# Altium schematic sheet Power.SchDoc
size A
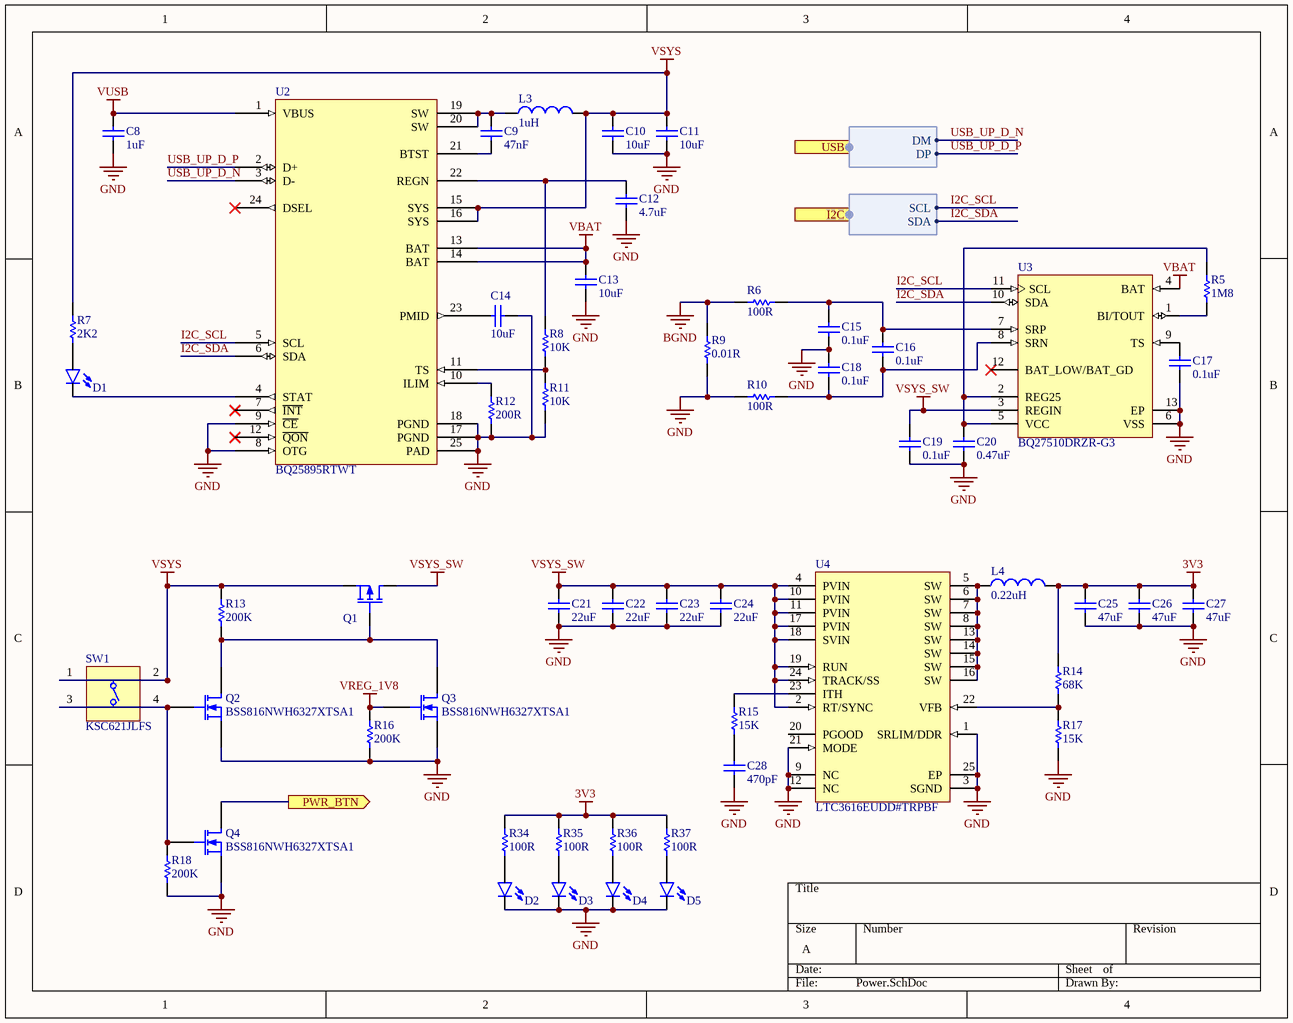
[diagram p0: Power.SchDoc]

## Parts
C8  value 1uF  [C0402[1005X55]]  (hidden comment: 1uF 16V 0402)
C9  value 47nF  [C0402[1005X55]]  (hidden comment: 47nF 16V 0402)
C10  value 10uF  [C0402[1005X55]]  (hidden comment: 10uF 6.3V 0402)
C11  value 10uF  [C0402[1005X55]]  (hidden comment: 10uF 6.3V 0402)
C12  value 4.7uF  [C0402[1005X55]]  (hidden comment: 4.7uF 10V 0402)
C13  value 10uF  [C0402[1005X55]]  (hidden comment: 10uF 6.3V 0402)
C14  value 10uF  [C0603[1608X92]]  (hidden comment: 10uF 35V 0603)
C15  value 0.1uF  [C0402[1005X55]]  (hidden comment: 0.1uF 6.3V 0402)
C16  value 0.1uF  [C0402[1005X55]]  (hidden comment: 0.1uF 6.3V 0402)
C17  value 0.1uF  [C0402[1005X55]]  (hidden comment: 0.1uF 6.3V 0402)
C18  value 0.1uF  [C0402[1005X55]]  (hidden comment: 0.1uF 6.3V 0402)
C19  value 0.1uF  [C0402[1005X55]]  (hidden comment: 0.1uF 6.3V 0402)
C20  value 0.47uF  [C0402[1005X55]]  (hidden comment: 0.47uF 25V 0402)
C21  value 22uF  [C0603[1608X92]]  (hidden comment: 22uF 6.3V 0603)
C22  value 22uF  [C0603[1608X92]]  (hidden comment: 22uF 6.3V 0603)
C23  value 22uF  [C0603[1608X92]]  (hidden comment: 22uF 6.3V 0603)
C24  value 22uF  [C0603[1608X92]]  (hidden comment: 22uF 6.3V 0603)
C25  value 47uF  [C1206[3216X160]]  (hidden comment: 47uF 6.3V 1206)
C26  value 47uF  [C1206[3216X160]]  (hidden comment: 47uF 6.3V 1206)
C27  value 47uF  [C1206[3216X160]]  (hidden comment: 47uF 6.3V 1206)
C28  value 470pF  [C0402[1005X55]]  (hidden comment: 470pF 50V 0402)
D1  LED_0603_GREEN_5mA  [LED0603]  (value not drawn)
D2  LED_0603_BLUE_5mA  [LED0603]  (value not drawn)
D3  LED_0603_BLUE_5mA  [LED0603]  (value not drawn)
D4  LED_0603_BLUE_5mA  [LED0603]  (value not drawn)
D5  LED_0603_BLUE_5mA  [LED0603]  (value not drawn)
L3  1uH  [IND1008]
L4  0.22uH  [IND1008]
Q1  SIS407DN-T1-GE3  [PowerPak-1212-8]  (value not drawn)
Q2  BSS816NWH6327XTSA1  [SOT323-3]
Q3  BSS816NWH6327XTSA1  [SOT323-3]
Q4  BSS816NWH6327XTSA1  [SOT323-3]
R5  value 1M8  [R0402[1005]]  (hidden comment: 1M8 1% 0402)
R6  value 100R  [R0402[1005]]  (hidden comment: 100R 1% 0402)
R7  value 2K2  [R0402[1005]]  (hidden comment: 2K2 1% 0402)
R8  value 10K  [R0402[1005]]  (hidden comment: 10K 1% 0402)
R9  value 0.01R  [R1206[3216]]  (hidden comment: 0.01R 1% 1206)
R10  value 100R  [R0402[1005]]  (hidden comment: 100R 1% 0402)
R11  value 10K  [R0402[1005]]  (hidden comment: 10K 1% 0402)
R12  value 200R  [R0402[1005]]  (hidden comment: 200R 1% 0402)
R13  value 200K  [R0402[1005]]  (hidden comment: 200K 1% 0402)
R14  value 68K  [R0402[1005]]  (hidden comment: 68K 1% 0402)
R15  value 15K  [R0402[1005]]  (hidden comment: 15K 1% 0402)
R16  value 200K  [R0402[1005]]  (hidden comment: 200K 1% 0402)
R17  value 15K  [R0402[1005]]  (hidden comment: 15K 1% 0402)
R18  value 200K  [R0402[1005]]  (hidden comment: 200K 1% 0402)
R34  value 100R  [R0402[1005]]  (hidden comment: 100R 1% 0402)
R35  value 100R  [R0402[1005]]  (hidden comment: 100R 1% 0402)
R36  value 100R  [R0402[1005]]  (hidden comment: 100R 1% 0402)
R37  value 100R  [R0402[1005]]  (hidden comment: 100R 1% 0402)
SW1  KSC621JLFS  [SWITCH]
U2  BQ25895RTWT  [WQFN-24]
U3  BQ27510DRZR-G3  [VSON-12]
U4  LTC3616EUDD#TRPBF  [LT-UDD-24_L]

## Ports
I2C (harness I2C), PWR_BTN (out), USB (harness USB)

## Harnesses
I2C: SCL, SDA
USB: DM, DP

## Nets
3V3: C25.2 C26.2 C27.2 L4.2 R14.2 R34.1 R35.1 R36.1 R37.1
BGND: R6.1 R9.2
GND: C8.1 C10.1 C11.1 C12.1 C13.1 C14.1 C15.1 C17.1 C18.2 C19.1 C20.1 C21.1 C22.1 C23.1 C24.1 C25.1 C26.1 C27.1 C28.1 D2.C D3.C D4.C D5.C Q2.2(S) Q3.2(S) Q4.2(S) R9.1 R10.1 R11.1 R12.1 R16.1 R17.1 R18.1 U2.8(OTG) U2.9(~{CE}) U2.17(PGND) U2.18(PGND) U2.25(PAD) U3.6(VSS) U3.13(EP) U4.1(SRLIM/DDR) U4.3(SGND) U4.9(NC) U4.12(NC) U4.21(MODE) U4.25(EP)
VBAT: C13.2 U2.13(BAT) U2.14(BAT) U3.4(BAT)
VREG_1V8: Q3.1(G) R16.2
VSYS: C10.2 C11.2 L3.2 Q1.1(S) R7.2 R13.2 SW1.1(T1) SW1.2(T2) U2.15(SYS) U2.16(SYS)
VSYS_SW: C19.2 C21.2 C22.2 C23.2 C24.2 Q1.3(D) U3.3(REGIN) U4.2(RT/SYNC) U4.4(PVIN) U4.10(PVIN) U4.11(PVIN) U4.17(PVIN) U4.18(SVIN) U4.19(RUN) U4.24(TRACK/SS)
VUSB: C8.2 U2.1(VBUS)
I2C_SCL: U2.5(SCL) U3.11(SCL) ; port I2C.SCL
I2C_SDA: U2.6(SDA) U3.10(SDA) ; port I2C.SDA
PWR_BTN: Q4.3(D) ; port PWR_BTN
USB_UP_D_N: U2.3(D-) ; port USB.DM
USB_UP_D_P: U2.2(D+) ; port USB.DP
NetC9_1: C9.1 U2.21(BTST)
NetC9_2: C9.2 L3.1 U2.19(SW) U2.20(SW)
NetC12_2: C12.2 R8.2 U2.22(REGN)
NetC14_2: C14.2 U2.23(PMID)
NetC15_2: C15.2 C16.2 R6.2 U3.7(SRP)
NetC16_1: C16.1 C18.1 R10.2 U3.8(SRN)
NetC17_2: C17.2 U3.9(TS)
NetC20_2: C20.2 R5.2 U3.2(REG25) U3.5(VCC)
NetC28_2: C28.2 R15.1
NetD1_A: D1.A R7.1
NetD1_C: D1.C U2.4(STAT)
NetD2_A: D2.A R34.2
NetD3_A: D3.A R35.2
NetD4_A: D4.A R36.2
NetD5_A: D5.A R37.2
NetL4_1: L4.1 U4.5(SW) U4.6(SW) U4.7(SW) U4.8(SW) U4.13(SW) U4.14(SW) U4.15(SW) U4.16(SW)
NetQ1_2: Q1.2(G) Q2.3(D) Q3.3(D) R13.1
NetQ2_1: Q2.1(G) Q4.1(G) R18.2 SW1.3(T3) SW1.4(T3)
NetR5_1: R5.1 U3.1(BI/TOUT)
NetR8_1: R8.1 R11.2 U2.11(TS)
NetR12_2: R12.2 U2.10(ILIM)
NetR14_1: R14.1 R17.2 U4.22(VFB)
NetR15_2: R15.2 U4.23(ITH)

Not connected (* = marked no-connect by the designer): U2 7(~{INT})* 12(~{QON})* 24(DSEL)*; U3 12(BAT_LOW/BAT_GD)*; U4 20(PGOOD)

## Library data of the parts
C8 = CAP_1uF_16V_0402_10%: 1uF 16V 10% 0402 (1005 Metric); PartNumber: GRM155R61C105KE01D; Manufacturer: Murata; Mounting Technology: Surface Mount; PackageReference: 0402; PackageDescription: 0402 (1005 Metric); Voltage: 16V; Tolerance: 10%
C9 = CAP_47nF_16V_0402_10%: 47nF 16V 10% 0402 (1005 Metric); PartNumber: GCM155R71C473KA37D; Manufacturer: Murata; Mounting Technology: Surface Mount; PackageReference: 0402; PackageDescription: 0402 (1005 Metric); Voltage: 16V; Tolerance: 10%
C10 C11 C13 = CAP_10uF_6.3V_0402_20%: 10uF 6.3V 20% 0402 (1005 Metric); PartNumber: GRM155R60J106ME44D; Manufacturer: Murata; Mounting Technology: Surface Mount; PackageReference: 0402; PackageDescription: 0402 (1005 Metric); Voltage: 6.3V; Tolerance: 20%
C12 = CAP_4.7uF_10V_0402_10%: 4.7uF 10V 10% 0402 (1005 Metric); PartNumber: ZRB15XR61A475KE01D; Manufacturer: Murata; Mounting Technology: Surface Mount; PackageReference: 0402; PackageDescription: 0402 (1005 Metric); Voltage: 10V; Tolerance: 10%
C14 = CAP_10uF_35V_0603_10%: 10uF 35V 10% 0603 (1608 Metric); PartNumber: GRM188R6YA106MA73D; Manufacturer: Murata; Mounting Technology: Surface Mount; PackageReference: 0603; PackageDescription: 0603 (1608 Metric); Voltage: 35V; Tolerance: 10%
C15-C19 = CAP_0.1uF_6.3V_0402_10%: 0.1uF 6.3V 10% 0402 (1005 Metric); PartNumber: GRM155R70J104KA01D; Manufacturer: Murata; Mounting Technology: Surface Mount; PackageReference: 0402; PackageDescription: 0402 (1005 Metric); Voltage: 6.3V; Tolerance: 10%
C20 = CAP_0.47uF_25V_0402_10%: 0.47uF 25V 10% 0402 (1005 Metric); PartNumber: GRM155R61E474KE01D; Manufacturer: Murata; Mounting Technology: Surface Mount; PackageReference: 0402; PackageDescription: 0402 (1005 Metric); Voltage: 25V; Tolerance: 10%
C21-C24 = CAP_22uF_6.3V_0603_10%: 22uF 6.3V 10% 0603 (1608 Metric); PartNumber: GRT188R60J226ME13D; Manufacturer: Murata; Mounting Technology: Surface Mount; PackageReference: 0603; PackageDescription: 0603 (1608 Metric); Voltage: 6.3V; Tolerance: 10%
C25-C27 = CAP_47uF_6.3V_1206_10%: 47uF 6.3V 10% 1206 (3216 Metric); PartNumber: GRM31CR60J476KE19L; Manufacturer: Murata; Mounting Technology: Surface Mount; PackageReference: 1206; PackageDescription: 1206 (3216 Metric); Voltage: 6.3V; Tolerance: 10%
C28 = CAP_470pF_50V_0402_5%: 470pF 50V 5% 0402 (1005 Metric); PartNumber: GCM1555C1H471JA16D; Manufacturer: Murata; Mounting Technology: Surface Mount; PackageReference: 0402; PackageDescription: 0402 (1005 Metric); Voltage: 50V; Tolerance: 5%
D1 = LED_0603_GREEN_5mA: PartNumber: LTST-C193TGKT-5A; Manufacturer: Lite-On Inc.; PackageReference: 0603; PackageDescription: 0603 (1608 Metric); Mounting Technology: Surface Mount
D2-D5 = LED_0603_BLUE_5mA: PartNumber: LTST-C193TBKT-5A; Manufacturer: Lite-On Inc.; PackageReference: 0603; PackageDescription: 0603 (1608 Metric); Mounting Technology: Surface Mount
L3 = IND_1uH_4.7A_1008_20%: 1uH 20% 4.7A 1008; PartNumber: DFE252012F-2R2M=P2; Manufacturer: Murata; PackageReference: 1008; PackageDescription: 1008 (2520 metric); Mounting Technology: Surface Mount; Current: 4.7A; Value: 1uH
L4 = IND_0.22uH_6.7A_1008_20%: 0.22uH 20% 6.7A 1008; PartNumber: TFM252012ALMAR22MTAA; Manufacturer: Murata; PackageReference: 1008; PackageDescription: 1008 (2520 metric); Mounting Technology: Surface Mount; Current: 6.7A; Value: 0.22uH
Q1 = SIS407DN-T1-GE3: P-Channel MOSFET; Manufacturer: Vishay; PartNumber: SIS407DN-T1-GE3; Mounting Technology: Surface Mount; PackageReference: PowerPAK-1212-8
Q2-Q4 = BSS816NWH6327XTSA1: N-Channel MOSFET; Manufacturer: Infineon Technologies; PartNumber: BSS816NWH6327XTSA1; PackageReference: SOT-323-3; Mounting Technology: Surface Mount
R5 = RES_1M8_0402_1%: 1M8 0.063W 1% 0402 (1005 Metric); Manufacturer: KOA Speer; PartNumber: RK73H1ETTP1804F; Tolerance: 1%; Power: 0.063W; Mounting Technology: Surface Mount; PackageReference: 0402; PackageDescription: 0402 (1005 Metric); ComponentLink1Description: Datasheet; ComponentLink1URL: http://www.koaspeer.com/catimages/Products/RK73H/RK73H.pdf
R6 R10 R34-R37 = RES_100R_0402_1%: 100R 0.063W 1% 0402 (1005 Metric); Manufacturer: KOA Speer; PartNumber: RK73H1ETTP1000F; Tolerance: 1%; Power: 0.063W; Mounting Technology: Surface Mount; PackageReference: 0402; PackageDescription: 0402 (1005 Metric); ComponentLink1Description: Datasheet; ComponentLink1URL: http://www.koaspeer.com/catimages/Products/RK73H/RK73H.pdf
R7 = RES_2K2_0402_1%: 2K2 0.063W 1% 0402 (1005 Metric); Manufacturer: KOA Speer; PartNumber: RK73H1ETTP2201F; Tolerance: 1%; Power: 0.063W; Mounting Technology: Surface Mount; PackageReference: 0402; PackageDescription: 0402 (1005 Metric); ComponentLink1Description: Datasheet; ComponentLink1URL: http://www.koaspeer.com/catimages/Products/RK73H/RK73H.pdf
R8 R11 = RES_10K_0402_1%: 10K 0.063W 1% 0402 (1005 Metric); Manufacturer: KOA Speer; PartNumber: RK73H1ETTP1002F; Tolerance: 1%; Power: 0.063W; Mounting Technology: Surface Mount; PackageReference: 0402; PackageDescription: 0402 (1005 Metric); ComponentLink1Description: Datasheet; ComponentLink1URL: http://www.koaspeer.com/catimages/Products/RK73H/RK73H.pdf
R9 = RES_0.01R_1206_1%_1.5W: 0.01R 1.5W 1% 1206 (3216 Metric); Manufacturer: KOA Speer; PartNumber: TLR2BPDTD10L0F75; Tolerance: 1%; Power: 1.5W; Mounting Technology: Surface Mount; PackageReference: 1206; PackageDescription: 1206 (3216 Metric)
R12 = RES_200R_0402_1%: 200R 0.063W 1% 0402 (1005 Metric); Manufacturer: KOA Speer; PartNumber: RK73H1ETTP2000F; Tolerance: 1%; Power: 0.063W; Mounting Technology: Surface Mount; PackageReference: 0402; PackageDescription: 0402 (1005 Metric); ComponentLink1Description: Datasheet; ComponentLink1URL: http://www.koaspeer.com/catimages/Products/RK73H/RK73H.pdf
R13 R16 R18 = RES_200K_0402_1%: 200K 0.063W 1% 0402 (1005 Metric); Manufacturer: KOA Speer; PartNumber: RK73H1ETTP2003F; Tolerance: 1%; Power: 0.063W; Mounting Technology: Surface Mount; PackageReference: 0402; PackageDescription: 0402 (1005 Metric); ComponentLink1Description: Datasheet; ComponentLink1URL: http://www.koaspeer.com/catimages/Products/RK73H/RK73H.pdf
R14 = RES_68K_0402_1%: 68K 0.063W 1% 0402 (1005 Metric); Manufacturer: KOA Speer; PartNumber: RK73H1ETTP6802F; Tolerance: 1%; Power: 0.063W; Mounting Technology: Surface Mount; PackageReference: 0402; PackageDescription: 0402 (1005 Metric); ComponentLink1Description: Datasheet; ComponentLink1URL: http://www.koaspeer.com/catimages/Products/RK73H/RK73H.pdf
R15 R17 = RES_15K_0402_1%: 15K 0.063W 1% 0402 (1005 Metric); Manufacturer: KOA Speer; PartNumber: RK73H1ETTP1502F; Tolerance: 1%; Power: 0.063W; Mounting Technology: Surface Mount; PackageReference: 0402; PackageDescription: 0402 (1005 Metric); ComponentLink1Description: Datasheet; ComponentLink1URL: http://www.koaspeer.com/catimages/Products/RK73H/RK73H.pdf
SW1 = KSC621JLFS: Switch, SPNO Push Button SMD; Manufacturer: C&K Components; Packing Type: Tape&Reel; Mechanical Life: 200,000 cycles; ComponentLink2URL: http://www.dip.com.tw/Products_tact.htm; ComponentLink1URL: http://www.dip.com.tw/; ComponentLink3URL: http://www.dip.com.tw/PDF/pro_tact/DTSM_G_-6_2_-V.pdf; PackageDescription: Switch, Surface Mount, 4 Leads, Body 6.2x6.2mm, Height 7.7mm; ComponentLink2Description: Datasheet; ComponentLink3Description: Package Specification; ComponentLink1Description: Manufacturer URL; PackageReference: KSC; PartNumber: KSC621JLFS; Mounting Technology: Surface Mount
U2 = BQ25895RTWT: IC NVDC CHARGER I2C 24WQFN; Manufacturer: Texas Instruments; PartNumber: BQ25895RTWT; PackageReference: WQFN-24; Mounting Technology: Surface Mount
U3 = BQ27510DRZR-G3: Battery Management System-Side Impedance Track Fuel Gauge; Manufacturer: Texas Instruments; PartNumber: BQ27510DRZR-G3; PackageReference: VSON-12; Mounting Technology: Surface Mount
U4 = CMP-0492-02186-1: 6 A, 4 MHz Monolithic Synchronous Step-Down DC/DC Converter, 24-pin QFN (UDD-24), -40 to 125 degC, Pb-Free, Tape and Reel; Manufacturer: Linear Technology; Frequency Adjust Range: Up - 4MHz; Number of Outputs: 1; ComponentLink3URL: http://cds.linear.com/docs/en/packaging/(UDD24)%20QFN%2005-08-1833%20Rev%20%C3%98.pdf; PartNumber: LTC3616EUDD#TRPBF; Packing: Tape and Reel; ComponentLink1URL: http://www.linear.com/; ComponentLink2URL: http://cds.linear.com/docs/en/datasheet/3616fa.pdf; Mounting Technology: Surface Mount; ComponentLink3Description: Package Specification; PackageVersion: Rev. Ã˜, 05/2011; ComponentLink1Description: Manufacturer URL; DatasheetVersion: Rev. A; ComponentLink2Description: Datasheet; RoHS: TRUE; PackageReference: UDD-24; PackageDescription: 24-Pin Plastic QFN, Body 5 x 3 mm, Pitch 0.5 mm